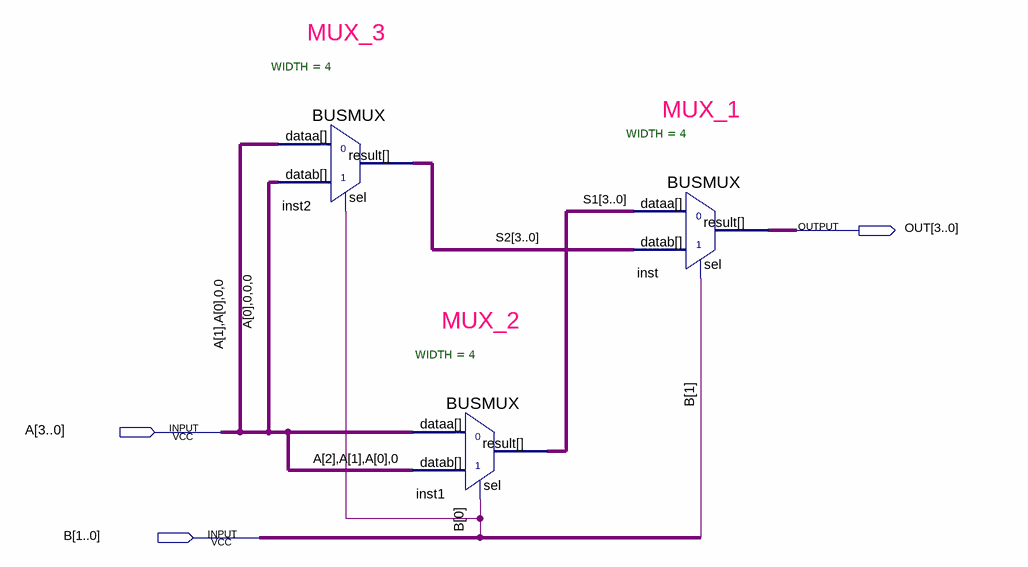
[diagram p0: schematic sheet]
// Quartus schematic shifter_busmux.bdf as structural Verilog: 3 symbols, 3 pins
module shifter_busmux (
  input  [3:0] A,
  input  [1:0] B,
  output [3:0] OUT
);

  wire \0 ;
  wire [3:0] S1, S2;

  BUSMUX #(.WIDTH(4)) inst2 (.datab({A[0], {3{\0 }}}), .sel(B[0]), .dataa({A[1:0], {2{\0 }}}), .result(S2));
  BUSMUX #(.WIDTH(4)) inst1 (.datab({A[2:0], \0 }), .sel(B[0]), .dataa({A[2:0], \0 }), .result(S1));
  BUSMUX #(.WIDTH(4)) inst (.datab(S2), .sel(B[1]), .dataa(S1), .result(OUT));

  // Notes on the sheet:
  //   MUX_3
  //   MUX_1
  //   MUX_2
endmodule
